# Altium project BPod Panel Due.PrjPcb
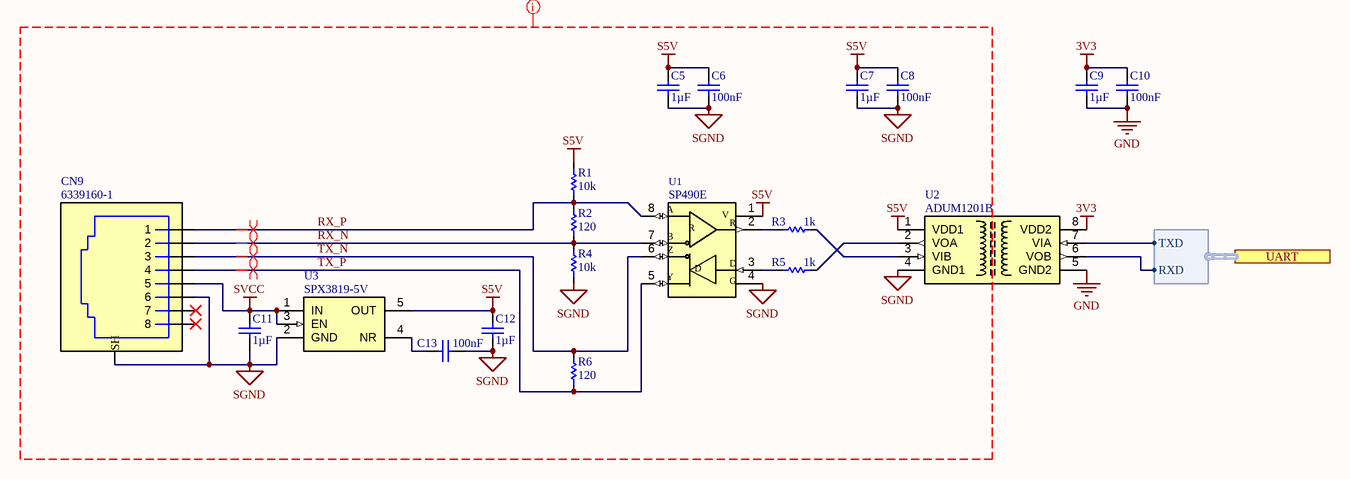
[diagram p0: Bpod Input.SchDoc]
Project: BPod Panel Due
4 sheets, 87 parts. Net scope: hierarchical (ports join the sheet entries above them; power ports are global).
Board file: BPod Panel Due.PcbDoc
Sheets:
  Bpod Input.SchDoc
  Arduino Due.SchDoc
  Digital IO LS.SchDoc
    Digital IO0 = Digital IO Connector.SchDoc
    Digital IO1 = Digital IO Connector.SchDoc
    Digital IO2 = Digital IO Connector.SchDoc
    Digital IO3 = Digital IO Connector.SchDoc
    Digital IO4 = Digital IO Connector.SchDoc
    Digital IO5 = Digital IO Connector.SchDoc
    Digital IO6 = Digital IO Connector.SchDoc
    Digital IO7 = Digital IO Connector.SchDoc

## Sheet Bpod Input.SchDoc
size 297 x 209 mm; CompanyName: Sainsbury Wellcome Centre; Organization: FabLab; Address1: Sainsbury Wellcome Centre; Address2: 25 Howland Street; Address3: London; Address4: W1T 4JG; DocumentNumber: 2; SheetNumber: 2; SheetTotal: 12; swcgroup: FabLab; Org: Sainsbury Wellcome Centre; Add1: 25 Howland Street; Add2: London; Add3: W1T 4JG; WebAddress: www.sainsburywellcome.org; SheetSize: A4; SheetName: Level Shifter

### Parts
C5  value 1µF  [CAP_CHIP_0603]  (hidden comment: C0603-1uF-50V)
C6  value 100nF  [CAP_CHIP_0603]  (hidden comment: C0603-100nF-50V)
C7  value 1µF  [CAP_CHIP_0603]  (hidden comment: C0603-1uF-50V)
C8  value 100nF  [CAP_CHIP_0603]  (hidden comment: C0603-100nF-50V)
C9  value 1µF  [CAP_CHIP_0603]  (hidden comment: C0603-1uF-50V)
C10  value 100nF  [CAP_CHIP_0603]  (hidden comment: C0603-100nF-50V)
C11  value 1µF  [CAP_CHIP_0603]  (hidden comment: C0603-1uF-50V)
C12  value 1µF  [CAP_CHIP_0603]  (hidden comment: C0603-1uF-50V)
C13  value 100nF  [CAP_CHIP_0603]  (hidden comment: C0603-100nF-50V)
CN9  RJ45-6339160-1  [6339160-1]  (value not drawn)
R1  value 10k  [RES_CHIP_0603]  (hidden comment: R0603-10K)
R2  value 120  [RES_CHIP_0603]  (hidden comment: R0603-120R)
R3  value 1k  [RES_CHIP_0603]  (hidden comment: R0603-1K)
R4  value 10k  [RES_CHIP_0603]  (hidden comment: R0603-10K)
R5  value 1k  [RES_CHIP_0603]  (hidden comment: R0603-1K)
R6  value 120  [RES_CHIP_0603]  (hidden comment: R0603-120R)
U1  SP490E  [SOIC8]
U2  ADUM1201B  [SOIC8]
U3  SPX3819-5V  [SOT23-5]

### Ports
UART (harness UART)

### Harnesses
UART: RXD, TXD

### Nets
3V3: C9.2 C10.2 U2.8(VDD2)
GND: C9.1 C10.1 U2.5(GND2)
S5V: C5.2 C6.2 C7.2 C8.2 C12.2 R1.2 U1.1(V) U2.1(VDD1) U3.5(OUT)
SGND: C5.1 C6.1 C7.1 C8.1 C11.1 C12.1 C13.1 CN9.0(SH) CN9.6 R4.1 U1.4(G) U2.4(GND1) U3.2(GND)
SVCC: C11.2 CN9.5 U3.1(IN) U3.3(EN)
RX_N: CN9.2 R2.1 R4.2 U1.7(B)
RX_P: CN9.1 R1.1 R2.2 U1.8(A)
TX_N: CN9.3 R6.2 U1.6(Z)
TX_P: CN9.4 R6.1 U1.5(Y)
NetC13_2: C13.2 U3.4(NR)
NetR3_1: R3.1 U1.2(R)
NetR3_2: R3.2 U2.3(VIB)
NetR5_1: R5.1 U1.3(D)
NetR5_2: R5.2 U2.2(VOA)
NetU2_6: U2.6(VOB) ; port UART.RXD
NetU2_7: U2.7(VIA) ; port UART.TXD

Not connected (* = marked no-connect by the designer): CN9 7* 8*

### Layout directives
mark named Isolated IO: RX_N, RX_P, S5V, SGND, SVCC, TX_N, TX_P
differential pair; differential pair class RS422: RX_N, RX_P, TX_N, TX_P

### Notes on the sheet
- FILE
- VARIANT
- DATE
- REVISION
- SHEET
- /
- PROJECT
- SIZE

### Library data of the parts
C5 C7 C9 C11 C12 = CMP-611-0033-11: 0603 Multilayer Ceramic Capacitors MLCC; PartNumber: CL10A105KB8NNNC; Pick&PlaceFootprint: C0603; Voltage Rating: 50V; Dielectric: X5R; Tolerance: 10%; Case/Package: 0603; RoHS: Yes; Capacitor Type: Ceramic; Mount: SMD; LCSC Part N.: C15849
C6 C8 C10 C13 = CMP-611-0027-24: 0603 Multilayer Ceramic Capacitors MLCC; PartNumber: CC0603KRX7R9BB104; Pick&PlaceFootprint: C0603; Dielectric: X7R; Voltage Rating: 50V; Tolerance: 10%; Case/Package: 0603; Capacitor Type: Ceramic; LCSC Part N.: C14663; Mount: SMD; RoHS: Yes
CN9 = CMP-390-0000-8: CONN MOD JACK 8P8C R/A SHIELDED; Pitch: 1.02mm; Element Configuration: Single; Gender: Female; Number of Contacts: 8; LCSC Part N.: C125076; Shielding: Shielded; Orientation: Right Angle; PartNumber: 6339160-1; Termination: SMD/SMT
R1 R4 = CMP-633-0002-26: 100mW Thick Film Resistors 75V ±100ppm/℃ ±1% 0603 Chip Resistor; PartNumber: 0603WAF1002T5E; Number of Resistors: 1; Pick&PlaceFootprint: R0603; Case/Package: 0603; Voltage Rating: 75V; Power Rating: 100mW; LCSC Part N.: C25804; Tolerance: 1%; Mount: Surface Mount
R2 R6 = CMP-633-0100-12: 100mW Thick Film Resistors 75V ±100ppm/℃ ±1% 0603 Chip Resistor; PartNumber: 0603WAF1200T5E; Pick&PlaceFootprint: R0603; Number of Resistors: 1; Mount: Surface Mount; Tolerance: 1%; Voltage Rating: 75V; Case/Package: 0603; Power Rating: 100mW; LCSC Part N.: C22787
R3 R5 = CMP-633-0013-26: 100mW Thick Film Resistors 75V ±100ppm/℃ ±1% 0603 Chip Resistor; PartNumber: 0603WAF1001T5E; Pick&PlaceFootprint: R0603; Number of Resistors: 1; Voltage Rating: 75V; Case/Package: 0603; Tolerance: 1%; Mount: Surface Mount; LCSC Part N.: C21190; Power Rating: 100mW
U1 = CMP-930-0018-1: TRANSCEIVER RS485, SMD, NSOIC8, 5V; Device Type: Line Driver / Receiver; IC Interface Type: RS422, RS485; No. of...; PartNumber: SP490EEN; Data Rate: 10Mbps; Simplex/Duplex: Full Duplex; LCSC Part N.: C19128
U2 = CMP-930-0008-4: General Purpose Digital Isolator 2500Vrms 2 Channel 10Mbps 25kV/µs CMTI 8-SOIC (0.154; PartNumber: ADUM1201BRZ-RL7; Max Supply Voltage: 5.5V; Data Rate: 25Mbps; Min Supply Voltage: 2.7V; LCSC Part N.: C87626; Pick&PlaceFootprint: SOIC8
U3 = CMP-970-0066-1: 500mA 70dB Fixed 3.3V Positive electrode 16V LDO; PartNumber: SPX3819M5-L-5-0/TR; Accuracy: 1%; Max Output Current: 800mA; Min Input Voltage: 2.5V; Output Noise: 40uV; Load Regulation: 0.05%; Output Voltage: 5V; Dropout Voltage: 340mV; Quiescent Current: 8uA; Line Regulation: 0.04%; Max Supply Voltage: 16V; PSRR: 70dB; Max Input Voltage: 16V; Output Current: 500mA; LCSC Part N.: C13417; Output Type: Fixed; Pick&PlaceFootprint: SOT23-5

## Sheet Arduino Due.SchDoc
size 297 x 209 mm; CompanyName: Sainsbury Wellcome Centre; Organization: FabLab; Address1: Sainsbury Wellcome Centre; Address2: 25 Howland Street; Address3: London; Address4: W1T 4JG; DocumentNumber: 3; SheetNumber: 3; SheetTotal: 12; swcgroup: FabLab; Org: Sainsbury Wellcome Centre; Add1: 25 Howland Street; Add2: London; Add3: W1T 4JG; WebAddress: www.sainsburywellcome.org; SheetSize: A4; SheetName: Arduino Due
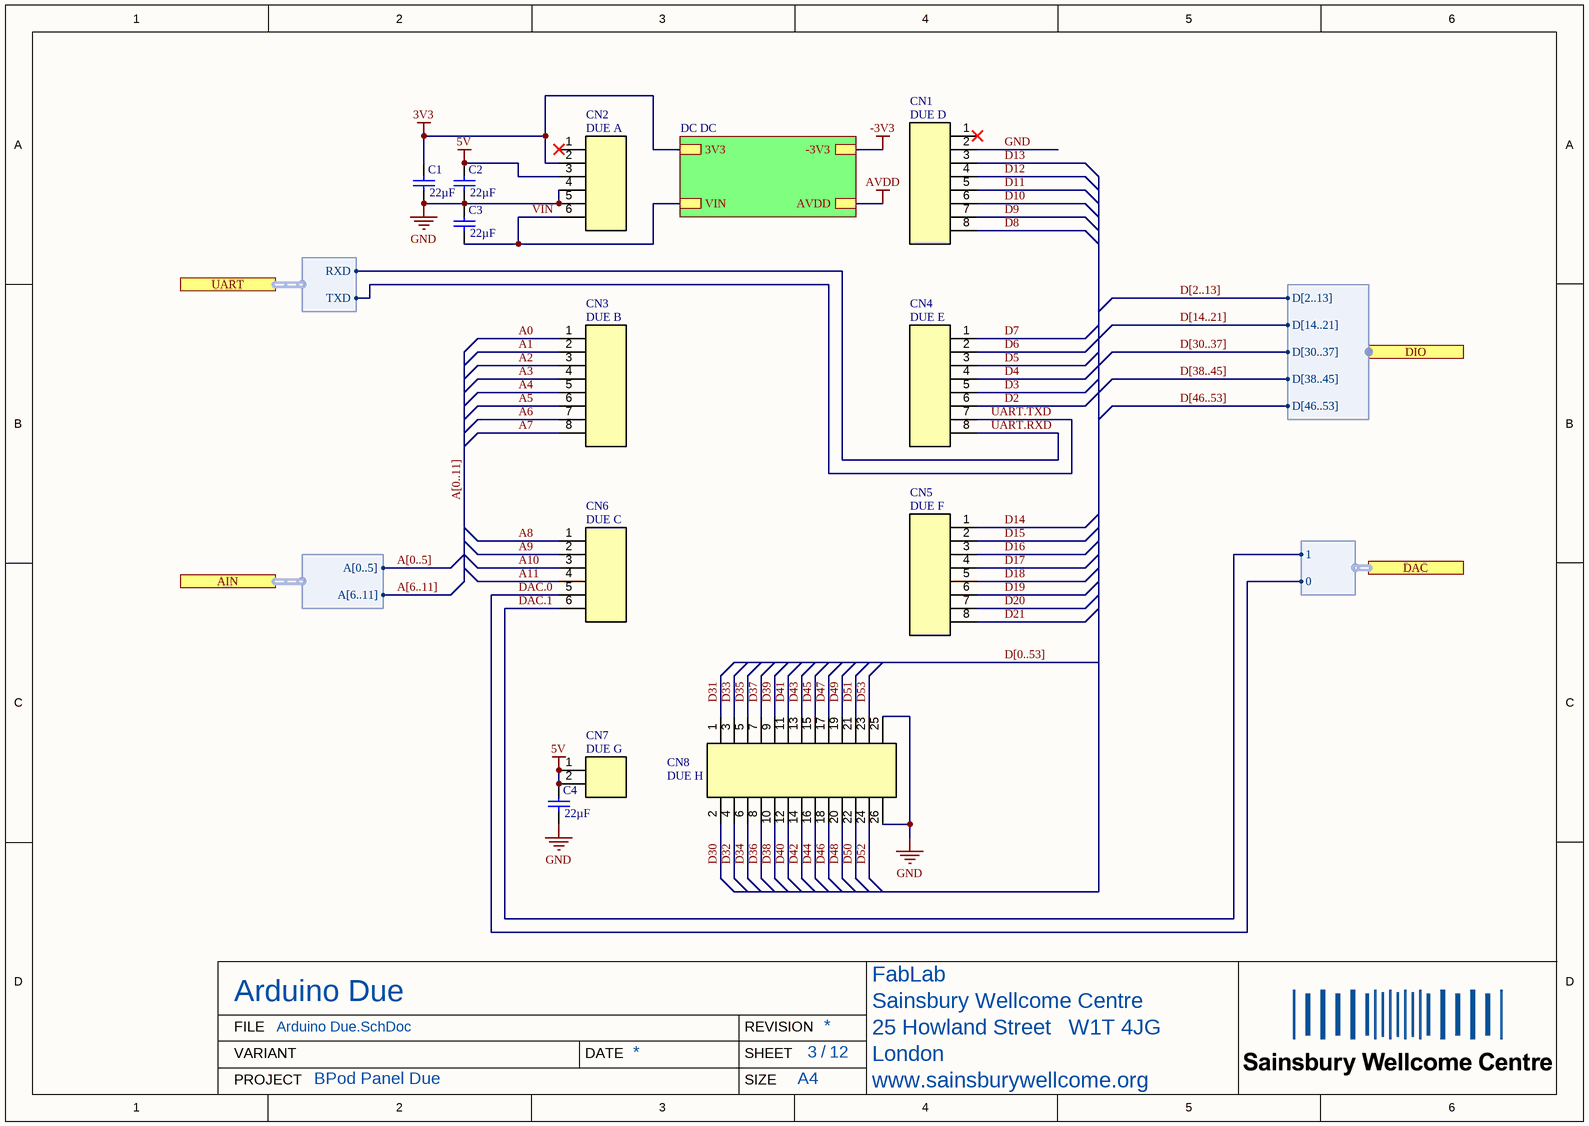
[diagram p1: Arduino Due.SchDoc]

### Parts
C1  value 22µF  [CAP_CHIP_0805]  (hidden comment: C0805-22uF-25V)
C2  value 22µF  [CAP_CHIP_0805]  (hidden comment: C0805-22uF-25V)
C3  value 22µF  [CAP_CHIP_0805]  (hidden comment: C0805-22uF-25V)
C4  value 22µF  [CAP_CHIP_0805]  (hidden comment: C0805-22uF-25V)
CN1  DUE D  [PIN_2.54_1X8P]
CN2  DUE A  [PIN_2.54_1X6P]
CN3  DUE B  [PIN_2.54_1X8P]
CN4  DUE E  [PIN_2.54_1X8P]
CN5  DUE F  [PIN_2.54_1X8P]
CN6  DUE C  [PIN_2.54_1X6P]
CN7  DUE G  [PIN_2.54_1X2P]
CN8  DUE H  [PIN_2.54_2X13P]

### Sub-sheets
DC DC = DC DC.SchDoc (file not in this document): VIN, 3V3, AVDD, -3V3

### Ports
AIN (harness AIN), DAC (harness DAC), DIO (harness DIO), UART (harness UART)

### Harnesses
AIN: A[6..11], A[0..5]
DIO: D[2..13], D[14..21], D[30..37], D[38..45], D[46..53]
DAC: 1, 0
UART: RXD, TXD

### Nets
3V3: C1.2 CN2.2 ; sheet DC DC/3V3
5V: C2.2 C4.2 CN2.3 CN7.1 CN7.2
-3V3: sheet DC DC/-3V3
AVDD: sheet DC DC/AVDD
GND: C1.1 C2.1 C3.2 C4.1 CN1.2 CN2.4 CN2.5 CN8.25 CN8.26
A0: CN3.1
A1: CN3.2
A2: CN3.3
A3: CN3.4
A4: CN3.5
A5: CN3.6
A6: CN3.7
A7: CN3.8
A8: CN6.1
A9: CN6.2
A10: CN6.3
A11: CN6.4
D2: CN4.6
D3: CN4.5
D4: CN4.4
D5: CN4.3
D6: CN4.2
D7: CN4.1
D8: CN1.8
D9: CN1.7
D10: CN1.6
D11: CN1.5
D12: CN1.4
D13: CN1.3
D14: CN5.1
D15: CN5.2
D16: CN5.3
D17: CN5.4
D18: CN5.5
D19: CN5.6
D20: CN5.7
D21: CN5.8
D30: CN8.2
D31: CN8.1
D32: CN8.4
D33: CN8.3
D34: CN8.6
D35: CN8.5
D36: CN8.8
D37: CN8.7
D38: CN8.10
D39: CN8.9
D40: CN8.12
D41: CN8.11
D42: CN8.14
D43: CN8.13
D44: CN8.16
D45: CN8.15
D46: CN8.18
D47: CN8.17
D48: CN8.20
D49: CN8.19
D50: CN8.22
D51: CN8.21
D52: CN8.24
D53: CN8.23
DAC.0: CN6.5 ; port DAC.0
DAC.1: CN6.6 ; port DAC.1
UART.RXD: CN4.8 ; port UART.RXD
UART.TXD: CN4.7 ; port UART.TXD
VIN: C3.1 CN2.6 ; sheet DC DC/VIN

Not connected (* = marked no-connect by the designer): CN1 1*; CN2 1*

### Buses and harness runs
bus A[0..5]
bus A[0..11]
bus A[6..11]
bus D[0..53]
bus D[2..13]
bus D[14..21]
bus D[30..37]
bus D[38..45]
bus D[46..53]

### Notes on the sheet
- FILE
- VARIANT
- DATE
- REVISION
- SHEET
- /
- PROJECT
- SIZE

### Library data of the parts
C1-C4 = CMP-611-0000-9: 0805 Multilayer Ceramic Capacitors MLCC; PartNumber: CL21A226MAQNNNE; Voltage Rating: 25V; Tolerance: 20%; Dielectric: X5R; Pick&PlaceFootprint: C0805; LCSC Part N.: C45783; Mount: SMD; RoHS: Yes; Capacitor Type: Ceramic; Case/Package: 0805
CN1 CN3-CN5 = CMP-380-0027-4: Straight Policy 2.5mm 8P 6mm -40℃~+105℃ 3mm 2.54mm Single Row Black Brass 1x10P Plugin,P=2.54mm Pin Headers ROHS; PartNumber: PZ254V-11-08P; Number of Positions: 8; Gender: Male; Number of Rows: 1; Orientation: Straight; Mount: Through Hole; Pitch: 2.54mm; LCSC Part N.: C492407; Number of Contacts: 8
CN2 CN6 = CMP-380-0028-3: Straight Policy 2.5mm 6P 6mm -40℃~+105℃ 3mm 2.54mm Single Row Black Brass 1x10P Plugin,P=2.54mm Pin Headers ROHS; PartNumber: PZ254V-11-06P; Number of Contacts: 6; Gender: Male; LCSC Part N.: C492405; Number of Positions: 6; Number of Rows: 1; Mount: Through Hole; Pitch: 2.54mm; Orientation: Straight
CN7 = CMP-380-0041-2: Straight Policy 2.5mm 6P 6mm -40℃~+105℃ 3mm 2.54mm Single Row Black Brass 1x10P Plugin,P=2.54mm Pin Headers ROHS; PartNumber: PZ254V-11-02P; Gender: Male; Number of Contacts: 2; Pitch: 2.54mm; Number of Rows: 1; Mount: Through Hole; LCSC Part N.: C492401; Number of Positions: 2; Orientation: Straight
CN8 = CMP-380-0040-1: Straight Policy 2.5mm 6mm -40℃~+105℃ 3mm 2.54mm Double Row Black Brass 2.54mm Plugin,P=2.54mm Pin Headers; PartNumber: PZ254-2-13-Z-8.5; Gender: Male; Number of Contacts: 24; Number of Positions: 12; Number of Rows: 2; Pitch: 2.54mm; Mount: Through Hole; LCSC Part N.: C2894974; Orientation: Straight

## Sheet Digital IO LS.SchDoc
size 297 x 209 mm; CompanyName: Sainsbury Wellcome Centre; Organization: FabLab; Address1: Sainsbury Wellcome Centre; Address2: 25 Howland Street; Address3: London; Address4: W1T 4JG; DocumentNumber: 9; SheetNumber: 9; SheetTotal: 12; swcgroup: FabLab; Org: Sainsbury Wellcome Centre; Add1: 25 Howland Street; Add2: London; Add3: W1T 4JG; WebAddress: www.sainsburywellcome.org; SheetSize: A4; SheetName: Level Shifter
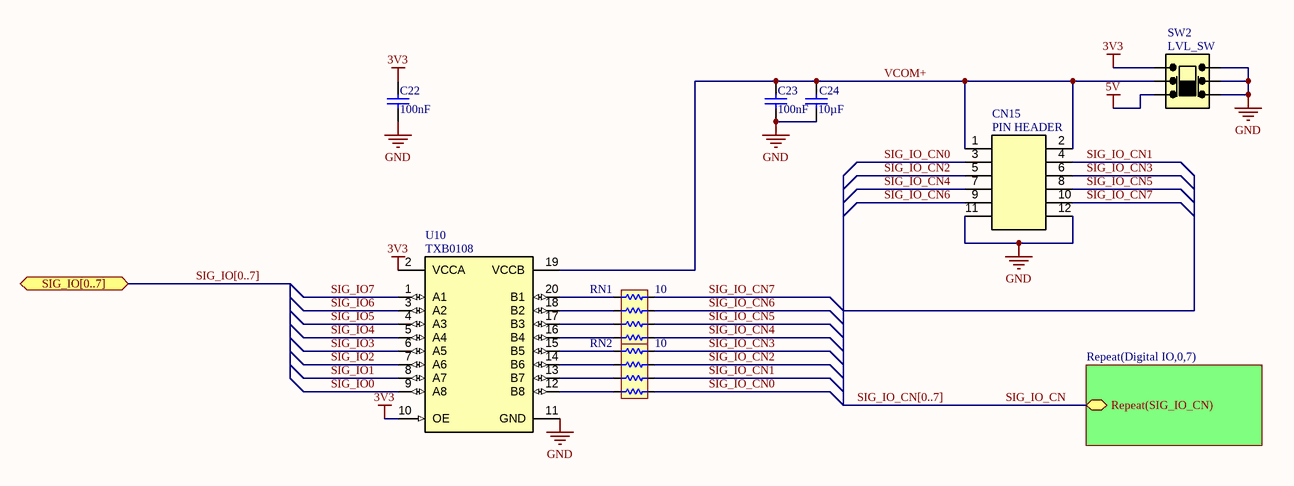
[diagram p2: Digital IO LS.SchDoc]

### Parts
C22  value 100nF  [CAP_CHIP_0603]  (hidden comment: C0603-100nF-50V)
C23  value 100nF  [CAP_CHIP_0603]  (hidden comment: C0603-100nF-50V)
C24  value 10µF  [CAP_CHIP_0603]  (hidden comment: C0603-10uF-35V)
CN15  PIN HEADER  [PIN_2.54_2X6P]
RN1  value 10  [RES_ARRAY_0603]  (hidden comment: RN0603-10R)
RN2  value 10  [RES_ARRAY_0603]  (hidden comment: RN0603-10R)
SW2  LVL_SW  [SW_SLIDE_OS202013MT8]
U10  TXB0108  [TSSOP20_6.5X4.4_0.65E]

### Sub-sheets
Repeat(Digital IO,0,7) = Digital IO Connector.SchDoc: Repeat(SIG_IO_CN) (bidir)

### Ports
SIG_IO[0..7] (bidir)

### Nets
3V3: C22.2 SW2.3(NOA) U10.2(VCCA) U10.10(OE)
5V: SW2.1(NCA)
GND: C22.1 C23.1 C24.1 CN15.11 CN15.12 SW2.4(NCB) SW2.5(COMB) SW2.6(NOB) U10.11(GND)
SIG_IO0: U10.9(A8)
SIG_IO1: U10.8(A7)
SIG_IO2: U10.7(A6)
SIG_IO3: U10.6(A5)
SIG_IO4: U10.5(A4)
SIG_IO5: U10.4(A3)
SIG_IO6: U10.3(A2)
SIG_IO7: U10.1(A1)
SIG_IO_CN: sheet Repeat(Digital IO,0,7)/Repeat(SIG_IO_CN)
SIG_IO_CN0: CN15.3 RN2.5
SIG_IO_CN1: CN15.4 RN2.6
SIG_IO_CN2: CN15.5 RN2.7
SIG_IO_CN3: CN15.6 RN2.8
SIG_IO_CN4: CN15.7 RN1.5
SIG_IO_CN5: CN15.8 RN1.6
SIG_IO_CN6: CN15.9 RN1.7
SIG_IO_CN7: CN15.10 RN1.8
VCOM+: C23.2 C24.2 CN15.1 CN15.2 SW2.2(COMA) U10.19(VCCB)
NetRN1_1: RN1.1 U10.20(B1)
NetRN1_2: RN1.2 U10.18(B2)
NetRN1_3: RN1.3 U10.17(B3)
NetRN1_4: RN1.4 U10.16(B4)
NetRN2_1: RN2.1 U10.15(B5)
NetRN2_2: RN2.2 U10.14(B6)
NetRN2_3: RN2.3 U10.13(B7)
NetRN2_4: RN2.4 U10.12(B8)

### Buses and harness runs
bus SIG_IO[0..7] = port SIG_IO[0..7]
bus SIG_IO_CN[0..7]

### Notes on the sheet
- FILE
- VARIANT
- DATE
- REVISION
- SHEET
- /
- PROJECT
- SIZE

### Library data of the parts
C22 C23 = CMP-611-0027-24: 0603 Multilayer Ceramic Capacitors MLCC; PartNumber: CC0603KRX7R9BB104; Tolerance: 10%; Pick&PlaceFootprint: C0603; Dielectric: X7R; Voltage Rating: 50V; Capacitor Type: Ceramic; RoHS: Yes; Mount: SMD; LCSC Part N.: C14663; Case/Package: 0603
C24 = CMP-611-0048-3: Ceramic Capacitor, Multilayer, Ceramic, 35V, 20% +Tol, 20% -Tol, X5R, 15% TC, 10uF, Surface Mount, 0603; PartNumber: GRM188R6YA106MA73D; Pick&PlaceFootprint: C0603; Dielectric: X5R; Capacitor Type: Ceramic; Mount: SMD; LCSC Part N.: C194427; RoHS: Yes; Tolerance: 20%; Voltage Rating: 35V; Case/Package: 0603
CN15 = CMP-380-0033-5: Straight Policy 2.5mm 6mm -40℃~+105℃ 3mm 2.54mm Double Row Black Brass 2.54mm Plugin,P=2.54mm Pin Headers; PartNumber: PZ254V-12-12P; Gender: Male; Number of Positions: 6; Number of Contacts: 12; Mount: Through Hole; Number of Rows: 2; Orientation: Straight; LCSC Part N.: C492423; Pitch: 2.54mm
RN1 RN2 = CMP-633-0183-1: Array/Network Resistor, Jumper, Metal Glaze/thick Film, 10ohm, 50V, 5% +/-Tol, -200,200ppm/Cel, Surface Mount, 1206; PartNumber: 4D03WGJ0100T5E; Element Power Dissipation: 62.5mW; Number of Resistors: 4; Pick&PlaceFootprint: R0603x4; LCSC Part N.: C11993; Voltage Rating: 50V; Power Rating: 62.5mW; Tolerance: 5%; Case/Package: 0612; Mount: SMD; RoHS: Yes
SW2 = CMP-B00-0028-1: Switch Slide ON ON DPDT Top Slide 0.3A 30VDC 10000Cycles PC Pins Thru-Hole Bulk; PartNumber: OS202013MT8QN1; Switch Travel: 3.2mm; Switch Function: On-On; Voltage Rating (DC): 30V; Throw Configuration: DPDT; Orientation: Straight; LCSC Part N.: C2799227
U10 = CMP-950-0024-1: 8-Bit Bidirectional Voltage-Level Shifter with Auto Direction Sensing and +/-15-kV ESD Protect 20-TSSOP -40 to 85; PartNumber: TXB0108PWR; Data Rate: 100Mbps; Output Type: 3-STATE; Number of Channels: 8; Min Supply Voltage: 1.2V; Max Supply Voltage: 5.5V; Propagation Delay: 4ns; Channel Type: Bidirectional; LCSC Part N.: C53406

## Sheet Digital IO Connector.SchDoc
size 297 x 209 mm; CompanyName: Sainsbury Wellcome Centre; Organization: FabLab; Address1: Sainsbury Wellcome Centre; Address2: 25 Howland Street; Address3: London; Address4: W1T 4JG; DocumentNumber: 8; SheetNumber: 8; SheetTotal: 12; swcgroup: FabLab; Org: Sainsbury Wellcome Centre; Add1: 25 Howland Street; Add2: London; Add3: W1T 4JG; WebAddress: www.sainsburywellcome.org; SheetSize: A4; SheetName: Analog Input A
Used 8 times, as channels Digital IO0, Digital IO1, Digital IO2, Digital IO3, Digital IO4, Digital IO5, Digital IO6, Digital IO7. Parts and nets are listed once, with the designators drawn on the sheet.
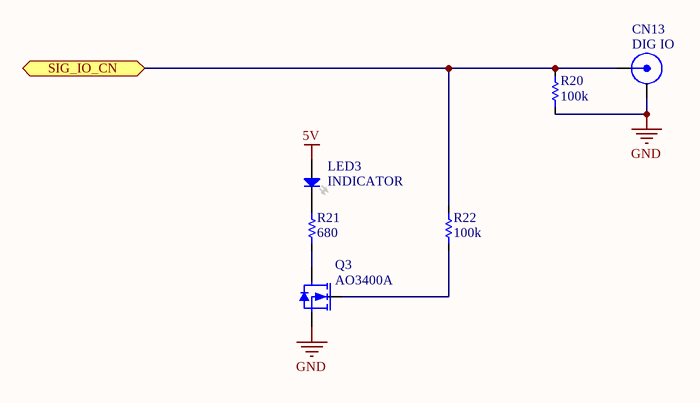
[diagram p3: Digital IO Connector.SchDoc]

### Parts
CN13  DIG IO  [BNC-AMP-112515]
LED3  INDICATOR  [LED_CHIP_0805]
Q3  AO3400A  [SOT23]
R20  value 100k  [RES_CHIP_0603]  (hidden comment: R0603-100K)
R21  value 680  [RES_CHIP_0603]  (hidden comment: R0603-680R)
R22  value 100k  [RES_CHIP_0603]  (hidden comment: R0603-100K)

### Ports
SIG_IO_CN (bidir)

### Nets
5V: LED3.2(A)
GND: CN13.2(GND) Q3.2(S) R20.1
SIG_IO_CN: CN13.1(SIG) R20.2 R22.2 ; port SIG_IO_CN
NetLED3_1: LED3.1(K) R21.2
NetQ3_1: Q3.1(G) R22.1
NetQ3_3: Q3.3(D) R21.1

### Channels
Digital IO0: designators end in _1; ports SIG_IO_CN=SIG_IO_CN0
Digital IO1: designators end in _2; ports SIG_IO_CN=SIG_IO_CN1
Digital IO2: designators end in _3; ports SIG_IO_CN=SIG_IO_CN2
Digital IO3: designators end in _4; ports SIG_IO_CN=SIG_IO_CN3
Digital IO4: designators end in _5; ports SIG_IO_CN=SIG_IO_CN4
Digital IO5: designators end in _6; ports SIG_IO_CN=SIG_IO_CN5
Digital IO6: designators end in _7; ports SIG_IO_CN=SIG_IO_CN6
Digital IO7: designators end in _8; ports SIG_IO_CN=SIG_IO_CN7

### Notes on the sheet
- FILE
- VARIANT
- DATE
- REVISION
- SHEET
- /
- PROJECT
- SIZE

### Library data of the parts
CN13 = CMP-730-0003-11: RF BNC Connector, Female, Board Mount, Solder Terminal, Jack; PartNumber: 112515; Clock Frequency: 4GHz; Characteristic Impedance: 50R; LCSC Part N.: C3176191; Orientation: Straight; Connector Type: BNC; Gender: Female
LED3 = CMP-520-0018-2: White 0805 Light Emitting Diodes (LED) ROHS; PartNumber: KT-0805W; Forward Current: 25mA; Wavelength: 405nm; Pick&PlaceFootprint: LED0805; Forward Voltage: 2.9V; Colour: White; LCSC Part N.: C34499; Mount: Surface Mount
Q3 = CMP-810-0002-2: 30V 5.7A 26.5mΩ@10V,5.7A 1.4W 1.5V@250uA 1 NChannel SOT-23-3L MOSFETs; Gate-Source Voltage (Vgs): 12V; Pick&PlaceFootprint: SOT-23; RDS(ON): 26.5mR; Switching Time: 34.5ns; LCSC Part N.: C20917; Drain-Source Voltage (Vds): 30V; Mount: Surface Mount; PartNumber: AO3400A; Power Dissipation: 1.4W; Drain Current (Id): 5.7A; Polarity: N Channel
R20 R22 = CMP-633-0000-28: 100mW Thick Film Resistors 75V ±100ppm/℃ ±1% 0603 Chip Resistor; PartNumber: 0603WAF1003T5E; Number of Resistors: 1; Pick&PlaceFootprint: R0603; LCSC Part N.: C25803; Mount: Surface Mount; Voltage Rating: 75V; Power Rating: 100mW; Case/Package: 0603; Tolerance: 1%
R21 = CMP-633-0087-12: 100mW Thick Film Resistors 75V ±100ppm/℃ ±1% 0603 Chip Resistor; PartNumber: 0603WAF6800T5E; Number of Resistors: 1; Pick&PlaceFootprint: R0603; Voltage Rating: 75V; Case/Package: 0603; Power Rating: 100mW; Tolerance: 1%; Mount: Surface Mount; LCSC Part N.: C23228

## Nets that join several sheets
3V3: Bpod Input (C9.2 C10.2 U2.8), Arduino Due (C1.2 CN2.2), Digital IO LS (C22.2 SW2.3 U10.2 U10.10)
5V: Arduino Due (5 pins), Digital IO LS (SW2.1), Digital IO0 (LED3_1.2), Digital IO1 (LED3_2.2), Digital IO2 (LED3_3.2), Digital IO3 (LED3_4.2), Digital IO4 (LED3_5.2), Digital IO5 (LED3_6.2), Digital IO6 (LED3_7.2), Digital IO7 (LED3_8.2)
GND: Bpod Input (C9.1 C10.1 U2.5), Arduino Due (9 pins), Digital IO LS (9 pins), Digital IO0 (CN13_1.2 Q3_1.2 R20_1.1), Digital IO1 (CN13_2.2 Q3_2.2 R20_2.1), Digital IO2 (CN13_3.2 Q3_3.2 R20_3.1), Digital IO3 (CN13_4.2 Q3_4.2 R20_4.1), Digital IO4 (CN13_5.2 Q3_5.2 R20_5.1), Digital IO5 (CN13_6.2 Q3_6.2 R20_6.1), Digital IO6 (CN13_7.2 Q3_7.2 R20_7.1), Digital IO7 (CN13_8.2 Q3_8.2 R20_8.1)
SIG_IO_CN0: Digital IO LS (CN15.3 RN2.5), Digital IO0 (CN13_1.1 R20_1.2 R22_1.2)
SIG_IO_CN1: Digital IO LS (CN15.4 RN2.6), Digital IO1 (CN13_2.1 R20_2.2 R22_2.2)
SIG_IO_CN2: Digital IO LS (CN15.5 RN2.7), Digital IO2 (CN13_3.1 R20_3.2 R22_3.2)
SIG_IO_CN3: Digital IO LS (CN15.6 RN2.8), Digital IO3 (CN13_4.1 R20_4.2 R22_4.2)
SIG_IO_CN4: Digital IO LS (CN15.7 RN1.5), Digital IO4 (CN13_5.1 R20_5.2 R22_5.2)
SIG_IO_CN5: Digital IO LS (CN15.8 RN1.6), Digital IO5 (CN13_6.1 R20_6.2 R22_6.2)
SIG_IO_CN6: Digital IO LS (CN15.9 RN1.7), Digital IO6 (CN13_7.1 R20_7.2 R22_7.2)
SIG_IO_CN7: Digital IO LS (CN15.10 RN1.8), Digital IO7 (CN13_8.1 R20_8.2 R22_8.2)